# EAGLE design StarControl (EAGLE 7.1.0)
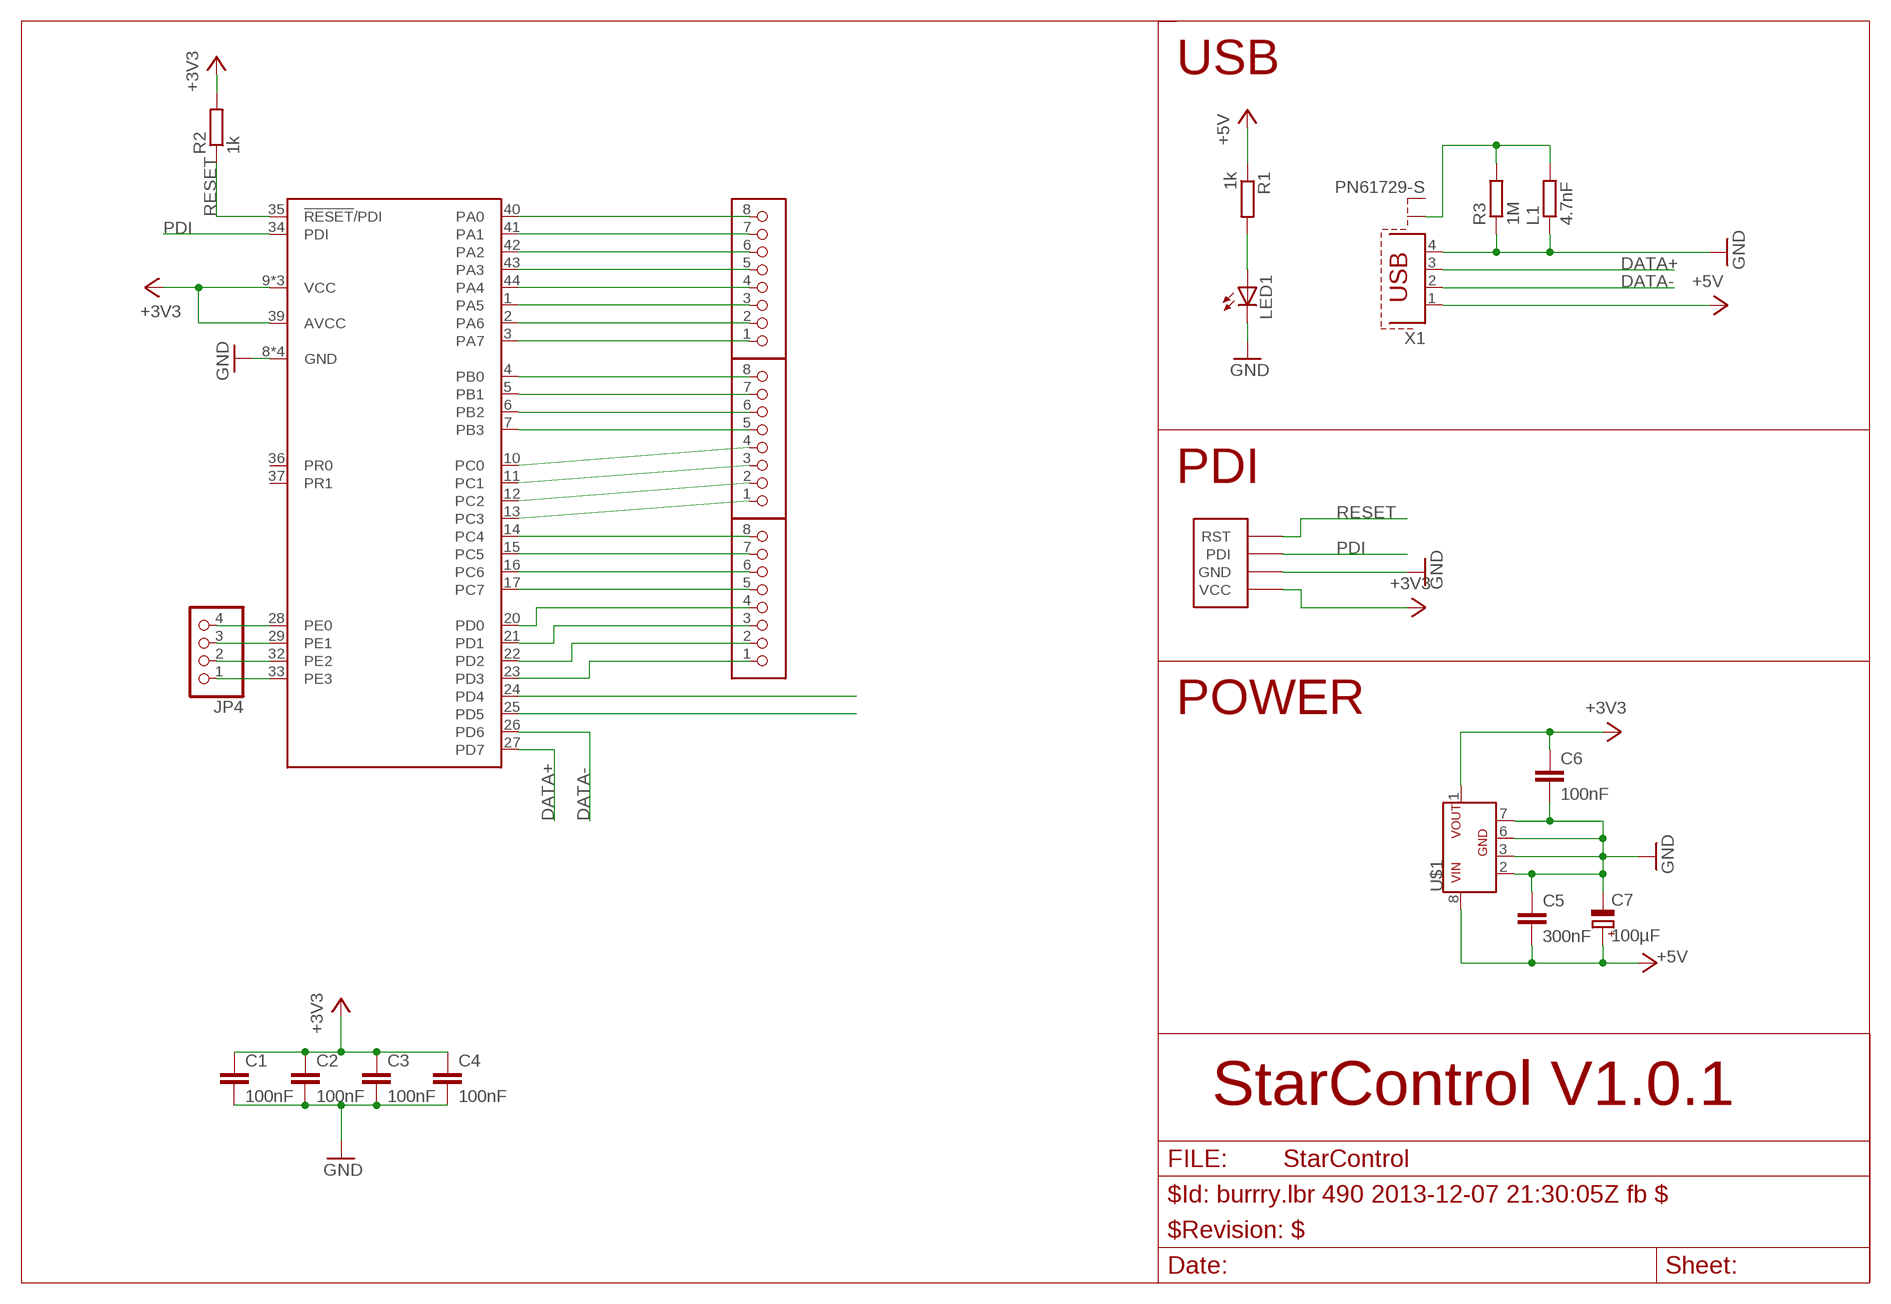
[diagram p0: schematic, sheet 1]

## Parts
C1  100nF  C-EUC0603K  [C0603K]
C2  100nF  C-EUC0603K  [C0603K]
C3  100nF  C-EUC0603K  [C0603K]
C4  100nF  C-EUC0603K  [C0603K]
C5  300nF  C-EUC1206  [C1206]
C6  100nF  C-EUC1206  [C1206]
C7  100µF  CPOL-EUE2.5-5  [E2,5-5]
JP4  PINHD-1X4  [1X04]
L1  4.7nF  R-EU_R0805  [R0805]
LED1  LED3MM  [LED3MM]
R1  1k  R-EU_R1206  [R1206]
R2  1k  R-EU_R0805  [R0805]
R3  1M  R-EU_R0805  [R0805]
U1  ATXMEGA16C4-AU  [TQFP-44A-44]
U$1  L78L33ACD13T  [SO-08]
U$2  PDI-4PIN  [1X04]
U$3  AKL059-08  [AKL059-08]
U$4  AKL059-08  [AKL059-08]
U$5  AKL059-08  [AKL059-08]
X1  PN61729-S  [PN61729-S]

## Nets
+3V3: C1.1 C2.1 C3.1 C4.1 C6.1 R2.2 U1.9(VCC) U1.19(VCC) U1.31(VCC) U1.39(AVCC) U$1.1 U$2.4(VCC)
+5V: C5.2 C7.+ R1.1 U$1.8 X1.1
DATA+: U1.27(PD7) X1.3
DATA-: U1.26(PD6) X1.2
GND: C1.2 C2.2 C3.2 C4.2 C5.1 C6.2 C7.- L1.1 LED1.K(C) R3.1 U1.8(GND) U1.18(GND) U1.30(GND) U1.38(GND) U$1.2 U$1.3 U$1.6 U$1.7 U$2.2(GND) X1.4
N$1: JP4.4 U1.28(PE0)
N$2: JP4.3 U1.29(PE1)
N$3: JP4.2 U1.32(PE2)
N$4: JP4.1 U1.33(PE3)
N$5: U1.4(PB0) U$5.8
N$6: U1.5(PB1) U$5.7
N$7: U1.6(PB2) U$5.6
N$8: U1.7(PB3) U$5.5
N$9: U1.40(PA0) U$4.8
N$10: U1.41(PA1) U$4.7
N$11: U1.42(PA2) U$4.6
N$12: U1.43(PA3) U$4.5
N$13: U1.44(PA4) U$4.4
N$14: U1.1(PA5) U$4.3
N$15: U1.2(PA6) U$4.2
N$16: U1.3(PA7) U$4.1
N$17: U1.10(PC0) U$5.4
N$18: U1.11(PC1) U$5.3
N$19: U1.12(PC2) U$5.2
N$20: U1.13(PC3) U$5.1
N$21: U1.17(PC7) U$3.5
N$22: U1.16(PC6) U$3.6
N$23: U1.15(PC5) U$3.7
N$24: U1.14(PC4) U$3.8
N$25: U1.20(PD0) U$3.4
N$26: U1.21(PD1) U$3.3
N$27: U1.22(PD2) U$3.2
N$28: U1.23(PD3) U$3.1
N$29: U1.24(PD4)
N$30: U1.25(PD5)
N$31: LED1.A R1.2
N$35: L1.2 R3.2 X1.S1
PDI: U1.34(PDI) U$2.1(PDI)
RESET: R2.1 U1.35(!RESET!/PDI) U$2.3(RST)
Unconnected: U1.36(PR0) U1.37(PR1) X1.S2

## Notes on the sheet
- USB
- PDI
- POWER
- StarControl V1.0.1

## Library data of the parts
C1-C6 = rcl:C-EU: CAPACITOR, European symbol
C7 = rcl:CPOL-EU: POLARIZED CAPACITOR, European symbol
JP4 = pinhead:PINHD-1X4: PIN HEADER
L1 R1-R3 = rcl:R-EU_: RESISTOR, European symbol
LED1 = led:LED: LED OSRAM: - CHIPLED LG R971, LG N971, LY N971, LG Q971, LY Q971, LO R971, LY R971 LH N974, LH R974 LS Q976, LO Q976, LY Q976 LO Q996 - Hyper CHIPLED LW Q18S LB Q993, LB Q99A, LB R99A - SideLED LS A670, LO A670, LY A670, LG A670, LP A670 LB A673, LV A673, LT A673, LW A673 LH A674 LY A675 LS A676, LA A676, LO A676, LY A676, LW A676 LS A679, LY A679, LG A679 - Hyper Micro SIDELED® LS Y876, LA Y876, LO Y876, LY Y876 LT Y87S - SmartLED LW L88C, LW L88S LB L89C, LB L89S, LG L890 LS L89K, LO L89K, LY L89K LS L896, LA L896, LO L896, LY L896 - TOPLED LS T670, LO T670, LY T670, LG T670, LP T670 LSG T670, LSP T670, LSY T670, LOP T670, LYG T670 LG T671, LOG T671, LSG T671 LB T673, LV T673, LT T673, LW T673 LH T674 LS T676, LA T676, LO T676, LY T676, LB T676, LH T676, LSB T676, LW T676 LB T67C, LV T67C, LT T67C, LS T67K, LO T67K, LY T67K, LW E67C LS E67B, LA E67B, LO E67B, LY E67B, LB E67C, LV E67C, LT E67C LW T67C LS T679, LY T679, LG T679 LS T770, LO T770, LY T770, LG T770, LP T770 LB T773, LV T773, LT T773, LW T773 LH T774 LS E675, LA E675, LY E675, LS T675 LS T776, LA T776, LO T776, LY T776, LB T776 LHGB T686 LT T68C, LB T68C - Hyper Mini TOPLED® LB M676 - Mini TOPLED Santana® LG M470 LS M47K, LO M47K, LY M47K Source: http://www.osram.convergy.de LUXEON: - LUMILED® LXK2-PW12-R00, LXK2-PW12-S00, LXK2-PW14-U00, LXK2-PW14-V00 LXK2-PM12-R00, LXK2-PM12-S00, LXK2-PM14-U00 LXK2-PE12-Q00, LXK2-PE12-R00, LXK2-PE12-S00, LXK2-PE14-T00, LXK2-PE14-U00 LXK2-PB12-K00, LXK2-PB12-L00, LXK2-PB12-M00, LXK2-PB14-N00, LXK2-PB14-P00, LXK2-PB14-Q00 LXK2-PR12-L00, LXK2-PR12-M00, LXK2-PR14-Q00, LXK2-PR14-R00 LXK2-PD12-Q00, LXK2-PD12-R00, LXK2-PD12-S00 LXK2-PH12-R00, LXK2-PH12-S00 LXK2-PL12-P00, LXK2-PL12-Q00, LXK2-PL12-R00 Source: www.luxeon.com KINGBRIGHT: KA-3528ASYC Source: www.kingbright.com
U1 = atmel-xmega:ATXMEGA16C4: 8/16-bit XMEGA C4 Microcontroller Features High-performance, low-power Atmel® AVR® XMEGA® 8/16-bit Microcontroller Nonvolatile program and data memories – 16K - 32KBytes of In-System Self-Programmable Flash – 4KBytes Boot Code Section with Independent Lock Bits – 1KBytes EEPROM – 2K - 4KBytes Internal SRAM Peripheral features – Four-channel event system – Four 16-bit timer/counters Three timer/counters with four output compare or input capture channels One timer/counter with two output compare or input capture channels High resolution extension on two timer/counters Advanced waveform extension (AWeX) on one timer/counter – One USB device interface USB 2.0 full speed (12Mbps) and low speed (1.5Mbps) device compliant 32 Endpoints with full configuration flexibility – Three USARTs with IrDA support for one USART – Two two-wire interfaces with dual address match (I2C and SMBus compatible) – Two serial peripheral interfaces (SPIs) – CRC-16 (CRC-CCITT) and CRC-32 (IEEE®802.3) generator – 16-bit real time counter (RTC) with separate oscillator – One sixteen-channel, 12-bit, 300ksps Analog to Digital Converter – Two Analog Comparators with window compare function, and current sources – External interrupts on all general purpose I/O pins – Programmable watchdog timer with separate on-chip ultra low power oscillator – QTouch® library support Capacitive touch buttons, sliders and wheels Special microcontroller features – Power-on reset and programmable brown-out detection – Internal and external clock options with PLL and prescaler – Programmable multilevel interrupt controller – Five sleep modes – Programming and debug interface PDI (program and debug interface) I/O and packages – 34 programmable I/O pins – 44-lead TQFP – 44-pad QFN – 49-ball VFBGA Operating voltage – 1.6 – 3.6V Operating frequency – 0 – 12MHz from 1.6V – 0 – 32MHz from 2.7V
U$1 = burrry:L78L33ACD13T: Positive voltage regulators
U$2 = burrry:PDI-4PIN
U$3-U$5 = burrry:AKL059-08
X1 = con-berg:PN61729-S: BERG USB connector; OC_FARNELL: unknown; OC_NEWARK: unknown

## Board
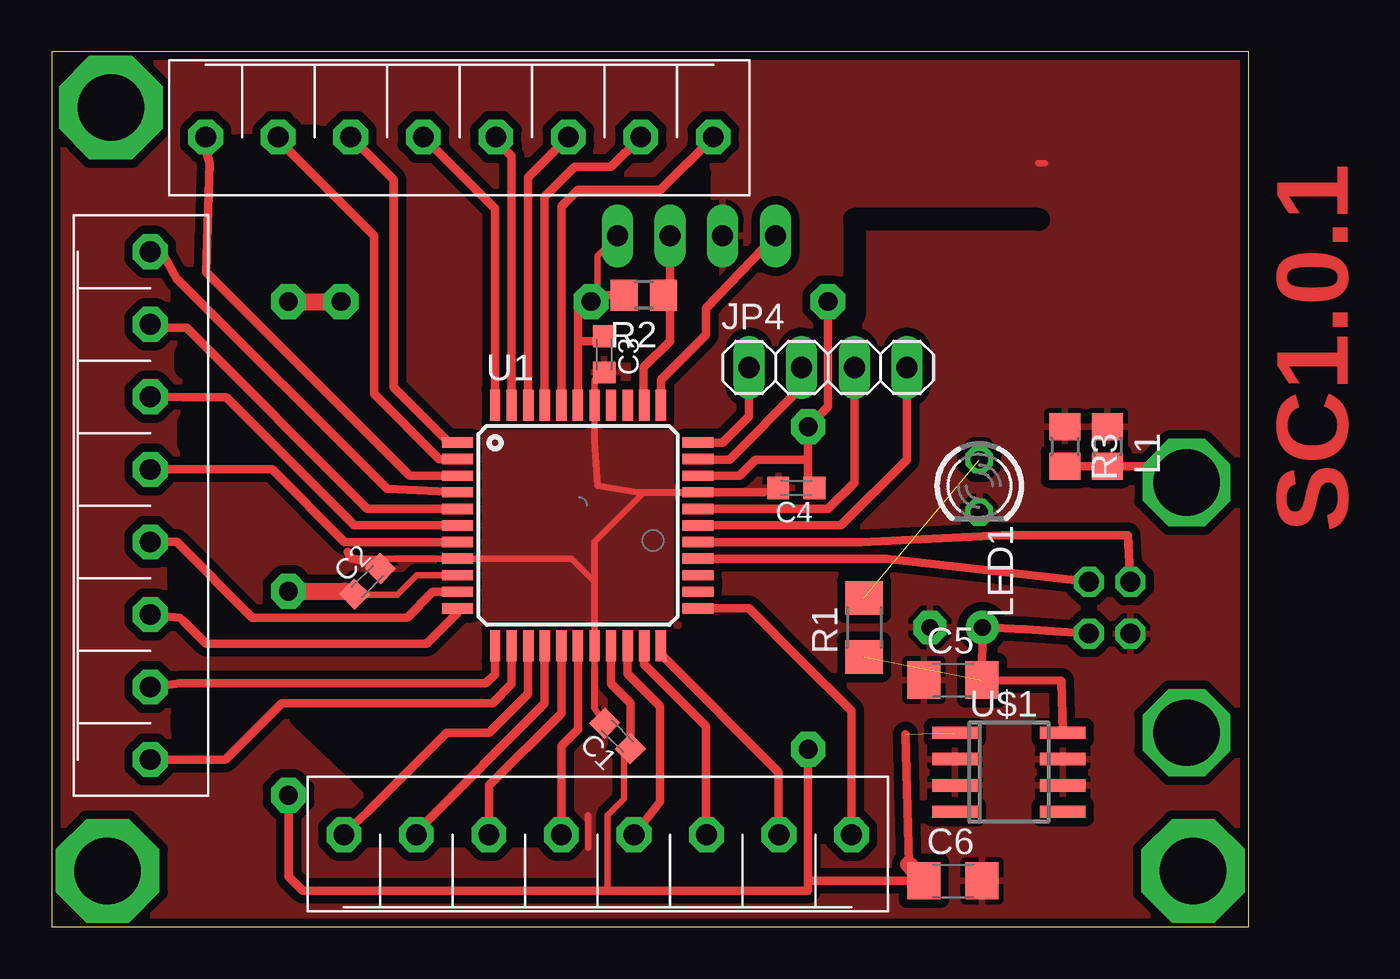
[diagram p1: board, top side]
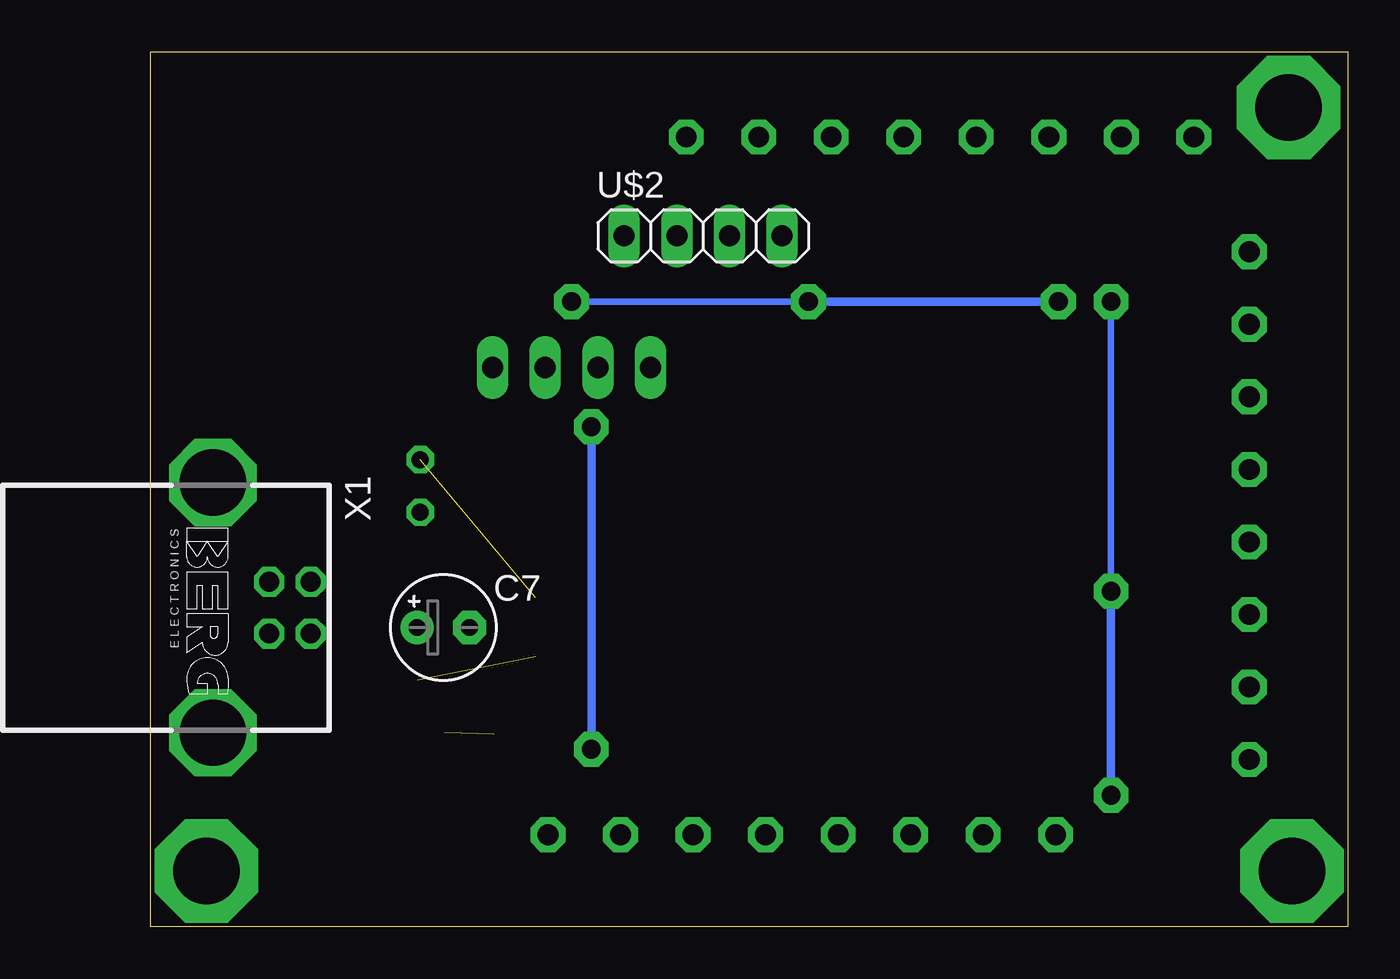
[diagram p2: board, bottom side, seen from below]

Size 57.77 x 42.22 mm. Coordinates in mm from the lower left corner, seen from the top.
Outline: 57.77,0 57.77,42.22 0,42.22 0,0 57.77,0
Copper layers (1*16): Top 0.035mm / dielectric 1.5mm / Bottom 0.035mm
Design rules "default *": minimum track width 10mil, minimum drill 24mil, track to track 8mil, track to pad 8mil, pad to pad 8mil, via to via 8mil, smd to smd 8mil, copper to edge 10mil, drill to drill 8mil, minimum pad ring 10mil, minimum via ring 8mil, stop-mask expansion 4mil, vias tented up to drill 0mil, thermal gap 10mil
tRestrict: 24 lines

### Footprints (pad centres in the part's own frame; a part is rotated, then mirrored left to right if it is on the bottom)
C0603K = smd 1.05 x 1.08: 1 -0.875,0; 2 0.875,0
C1206 = smd 1.6 x 1.8: 1 -1.4,0; 2 1.4,0
E2,5-5 = drill 0.813 pad 1.6: + -1.27,0 | drill 0.813 pad 1.6 octagon: - 1.27,0
1X04 = drill 1.016 long: 1 -3.81,0; 2 -1.27,0; 3 1.27,0; 4 3.81,0
R0805 = smd 1.3 x 1.5: 1 -0.95,0; 2 0.95,0
LED3MM = drill 0.813 octagon: A -1.27,0; K 1.27,0
R1206 = smd 1.6 x 1.803: 1 -1.422,0; 2 1.422,0
TQFP-44A-44 = smd 1.5 x 0.5: 1 -5.8,4; 2 -5.8,3.2; 3 -5.8,2.4; 4 -5.8,1.6; 5 -5.8,0.8; 6 -5.8,0; 7 -5.8,-0.8; 8 -5.8,-1.6; 9 -5.8,-2.4; 10 -5.8,-3.2; 11 -5.8,-4; 23 5.8,-4; 24 5.8,-3.2; 25 5.8,-2.4; 26 5.8,-1.6; 27 5.8,-0.8; 28 5.8,0; 29 5.8,0.8; 30 5.8,1.6; 31 5.8,2.4; 32 5.8,3.2; 33 5.8,4 | smd 0.5 x 1.5: 12 -4,-5.8; 13 -3.2,-5.8; 14 -2.4,-5.8; 15 -1.6,-5.8; 16 -0.8,-5.8; 17 0,-5.8; 18 0.8,-5.8; 19 1.6,-5.8; 20 2.4,-5.8; 21 3.2,-5.8; 22 4,-5.8; 34 4,5.8; 35 3.2,5.8; 36 2.4,5.8; 37 1.6,5.8; 38 0.8,5.8; 39 0,5.8; 40 -0.8,5.8; 41 -1.6,5.8; 42 -2.4,5.8; 43 -3.2,5.8; 44 -4,5.8
SO-08 = smd 0.6 x 2.2: 1 -1.905,-2.6; 2 -0.635,-2.6; 3 0.635,-2.6; 4 1.905,-2.6; 5 1.905,2.6; 6 0.635,2.6; 7 -0.635,2.6; 8 -1.905,2.6
AKL059-08 = drill 1 pad 1.676 octagon: 1 0,-12.25; 2 0,-8.75; 3 0,-5.25; 4 0,-1.75; 5 0,1.75; 6 0,5.25; 7 0,8.75; 8 0,12.25
PN61729-S = drill 0.95 octagon: 1 1.25,4.71; 2 -1.25,4.71; 3 -1.25,2.71; 4 1.25,2.71 | drill 2.3 pad 2.9: S1 -6.02,0; S2 6.02,0

### Placement (x,y rotation side)
C1  27.29,9.21 135 top
C2  15.23,16.67 45 top
C3  26.66,27.62 270 top
C4  35.93,21.18 180 top
C5  43.49,11.91 0 top
C6  43.49,2.22 0 top
C7  43.65,14.45 0 bottom
JP4  37.46,26.99 0 top
L1  50.95,23.18 270 top
LED1  44.76,21.27 270 top
R1  39.2,14.45 90 top
R2  28.56,30.48 180 top
R3  48.89,23.18 270 top
U1  25.39,19.37 0 top
U$1  46.19,7.46 270 top
U$2  31.1,33.34 0 bottom
U$3  26.34,4.45 90 top
U$4  19.67,38.1 270 top
U$5  4.75,20.32 0 top
X1  54.76,15.4 270 bottom

### Tracks (layer width: path | path; a pad name or v marks a point on that pad's centre or on a via)
+3V3  (via drill 0.9 pad 1.68)  (1 unrouted)
  Top 0.305: U1.9 17.61,16.97 16.66,16.02 14.75,16.03 14.45,15.86 C2.1 14.15,16.19 | 36.5,21.33 C4.1 | 26.82,1.75 26.82,5.4 27.61,6.19 27.61,8.29 C1.1 27.93,8.61 27.93,8.73 | 26.34,30.48 26.34,32.38 U$2.4
  Top 0.406: U1.31 33.19,21.77 33.96,22.54 36.5,22.54 | U1.19 26.99,11.73 27.93,10.79 27.93,8.73 | 36.5,2.22 v36.5,8.57 | 41.36,3.02 41.2,9.3 | C6.1 36.5,2.22 | v11.42,6.35 11.42,2.43 12.1,1.75 26.82,1.75 36.5,1.75 36.5,2.22 | U1.39 25.39,28.26 | 25.39,28.26 25.39,29.84 v26.02,30.16 26.18,30.64 26.34,30.48 R2.2 | C3.1 26.42,28.26 25.39,28.26 | 36.5,22.54 v36.5,24.13 37.46,25.08 v37.46,30.16 | 36.5,22.54 36.5,21.48 C4.1
  Top 0.813: v11.42,16.19 14.15,16.19 | v11.42,30.16 v13.96,30.16 | C6.1 41.36,3.02
  Bottom 0.305: v11.42,30.16 v11.42,16.19 | v26.02,30.16 v37.46,30.16
  Bottom 0.406: v36.5,24.13 v36.5,8.57 | v11.42,6.35 v11.42,16.19 | v13.96,30.16 25.87,30.16 25.87,30.32
+5V  (1 unrouted)
  Top 0.406: X1.1 46.98,14.36 C7.+ C5.2 48.73,11.88 U$1.8
DATA+
  Top 0.406: U1.27 39.04,18.57 45.87,18.89 51.93,18.89 X1.3
DATA-
  Top 0.406: U1.26 40.27,17.77 X1.2
GND
  Top 0.305: C2.2 14.58,17.77 U1.8 25.08,17.77 26.19,16.66 | 34.37,20.97 C4.2 | 26.19,16.66 U1.18 26.19,10.55 C1.2 | 26.19,16.66 26.19,18.58 28.56,20.95 31.18,20.95 U1.30 28.23,20.97 26.34,21.27 26.18,23.43 U1.38 26.19,26.35 26.34,26.67 | 47.62,36.83 47.93,36.83 | 25.87,3.81 25.87,5.4
  Top 0.406: U1.30 34.37,20.97 | C3.2 26.34,26.67 | 14.28,18.1 14.44,17.78 15.87,17.46
  pour Top (isolate 0.406): 57.77,0 57.77,42.23 -0.01,42.23 -0.01,0
N$1
  Top 0.406: U1.28 38.09,19.37 41.27,22.54 JP4.4
N$2
  Top 0.406: U1.29 37.46,20.17 38.73,21.44 JP4.3
N$3
  Top 0.305: U1.32 30.79,22.57 30.79,22.54
  Top 0.406: 30.79,22.54 32.69,22.54 36.19,26.04 JP4.2
N$4
  Top 0.406: U1.33 32.38,23.37 33.65,24.64 JP4.1
N$5
  Top 0.406: U1.4 16.17,21.13 6.02,31.27 5.39,32.41 U$5.8
N$6
  Top 0.406: U1.5 15.22,20.17 6.5,28.89 5.69,28.89 U$5.7
N$7
  Top 0.406: U1.6 14.6,19.37 8.4,25.56 6.33,25.56 U$5.6
N$8
  Top 0.406: U1.7 14.12,18.57 10.63,22.07 6.34,22.07 U$5.5
N$9
  Top 0.406: U1.40 24.59,34.76 25.39,35.56 29.38,35.56 U$4.8
N$10
  Top 0.406: U1.41 23.79,35.23 25.23,36.67 27,36.67 U$4.7
N$11
  Top 0.406: U1.42 22.99,36.16 U$4.6
N$12
  Top 0.406: U1.43 22.19,37.17 21.26,38.1 21.26,37.94 U$4.5
N$13
  Top 0.406: U1.44 21.39,34.64 18.09,37.94 U$4.4
N$14
  Top 0.406: U1.1 19.17,23.37 16.5,26.04 16.5,36.04 15.07,37.47 14.28,37.95 U$4.3
N$15
  Top 0.406: U1.2 18.7,22.57 15.55,25.72 15.55,33.34 10.94,37.94 10.79,37.96 U$4.2
N$16
  Top 0.406: U1.3 17.27,21.77 7.45,31.59 7.61,36.83 7.29,37.94 7.29,37.97 U$4.1
N$17
  Top 0.406: U1.10 18.38,16.17 17.13,14.92 9.67,14.92 6.02,18.57 5.23,18.57 U$5.4
N$18
  Top 0.406: U1.11 19.59,15.15 18.09,13.65 7.45,13.65 6.34,14.76 6.17,14.92 U$5.3
N$19
  Top 0.406: U1.12 21.39,12.19 20.94,11.75 6.2,11.75 U$5.2
N$20
  Top 0.406: U1.13 22.19,11.72 21.26,10.79 11.1,10.79 8.38,8.07 U$5.1
N$21
  Top 0.406: U1.17 25.39,9.53 24.6,8.73 U$3.5
N$22
  Top 0.406: U1.16 24.59,10.31 21.1,6.83 21.1,4.46 U$3.6
N$23
  Top 0.406: U1.15 23.79,10.78 17.77,4.76 17.77,4.62 U$3.7
N$24
  Top 0.406: U1.14 22.99,11.25 21.1,9.37 19.04,9.37 15.23,5.56 14.6,4.95 U$3.8
N$25
  Top 0.406: U1.20 27.79,12.21 29.36,10.64 29.36,6.03 28.25,4.6 U$3.4
N$26
  Top 0.406: U1.21 28.59,12.68 31.58,9.68 U$3.3
N$27
  Top 0.406: U1.22 29.39,13.14 35.07,7.46 35.07,4.46 U$3.2
N$28
  Top 0.406: U1.23 33.65,15.37 36.19,12.83 38.59,10.42 U$3.1
N$31  (1 unrouted)
N$32  (via drill 3.2 pad 5)
  other vias: 2.69,2.7
N$33  (via drill 3.2 pad 5)
  other vias: 55.08,2.7
N$34  (via drill 3.2 pad 5)
  other vias: 2.85,39.53
N$35
  Top 0.406: R3.2 L1.2 54.76,22.23 X1.S1
N$36  (via drill 3.2 pad 1.68)
  other vias: 54.76,9.37
N$37  (via drill 3.2 pad 1.68)
  other vias: 54.76,21.43
PDI
  Top 0.406: U$2.1 31.58,29.84 31.58,28.57 29.39,26.38 U1.34
RESET
  Top 0.305: U1.35 28.56,25.17
  Top 0.406: 28.56,25.17 28.56,26.99 29.83,28.26 29.83,30.48 | 29.83,30.48 U$2.3 | R2.1 29.83,30.48

### Text on the board
Top: SC1.0.1